# EasyEDA Pro project v4_a.eprj

# Schematic Schematic1
Board Name: Board1; Create Date: 2023-01-16; Page Name: P1; Project Name: v4_a; Schematic Name: Schematic1; Update Date: 2024-11-25; Company: KC3LBR; Drawed: EasyEDA Pro; Page Size: A3; Part Number: JLCPCB-001; Reviewed: EasyEDA Pro; Version: 2023.09.11
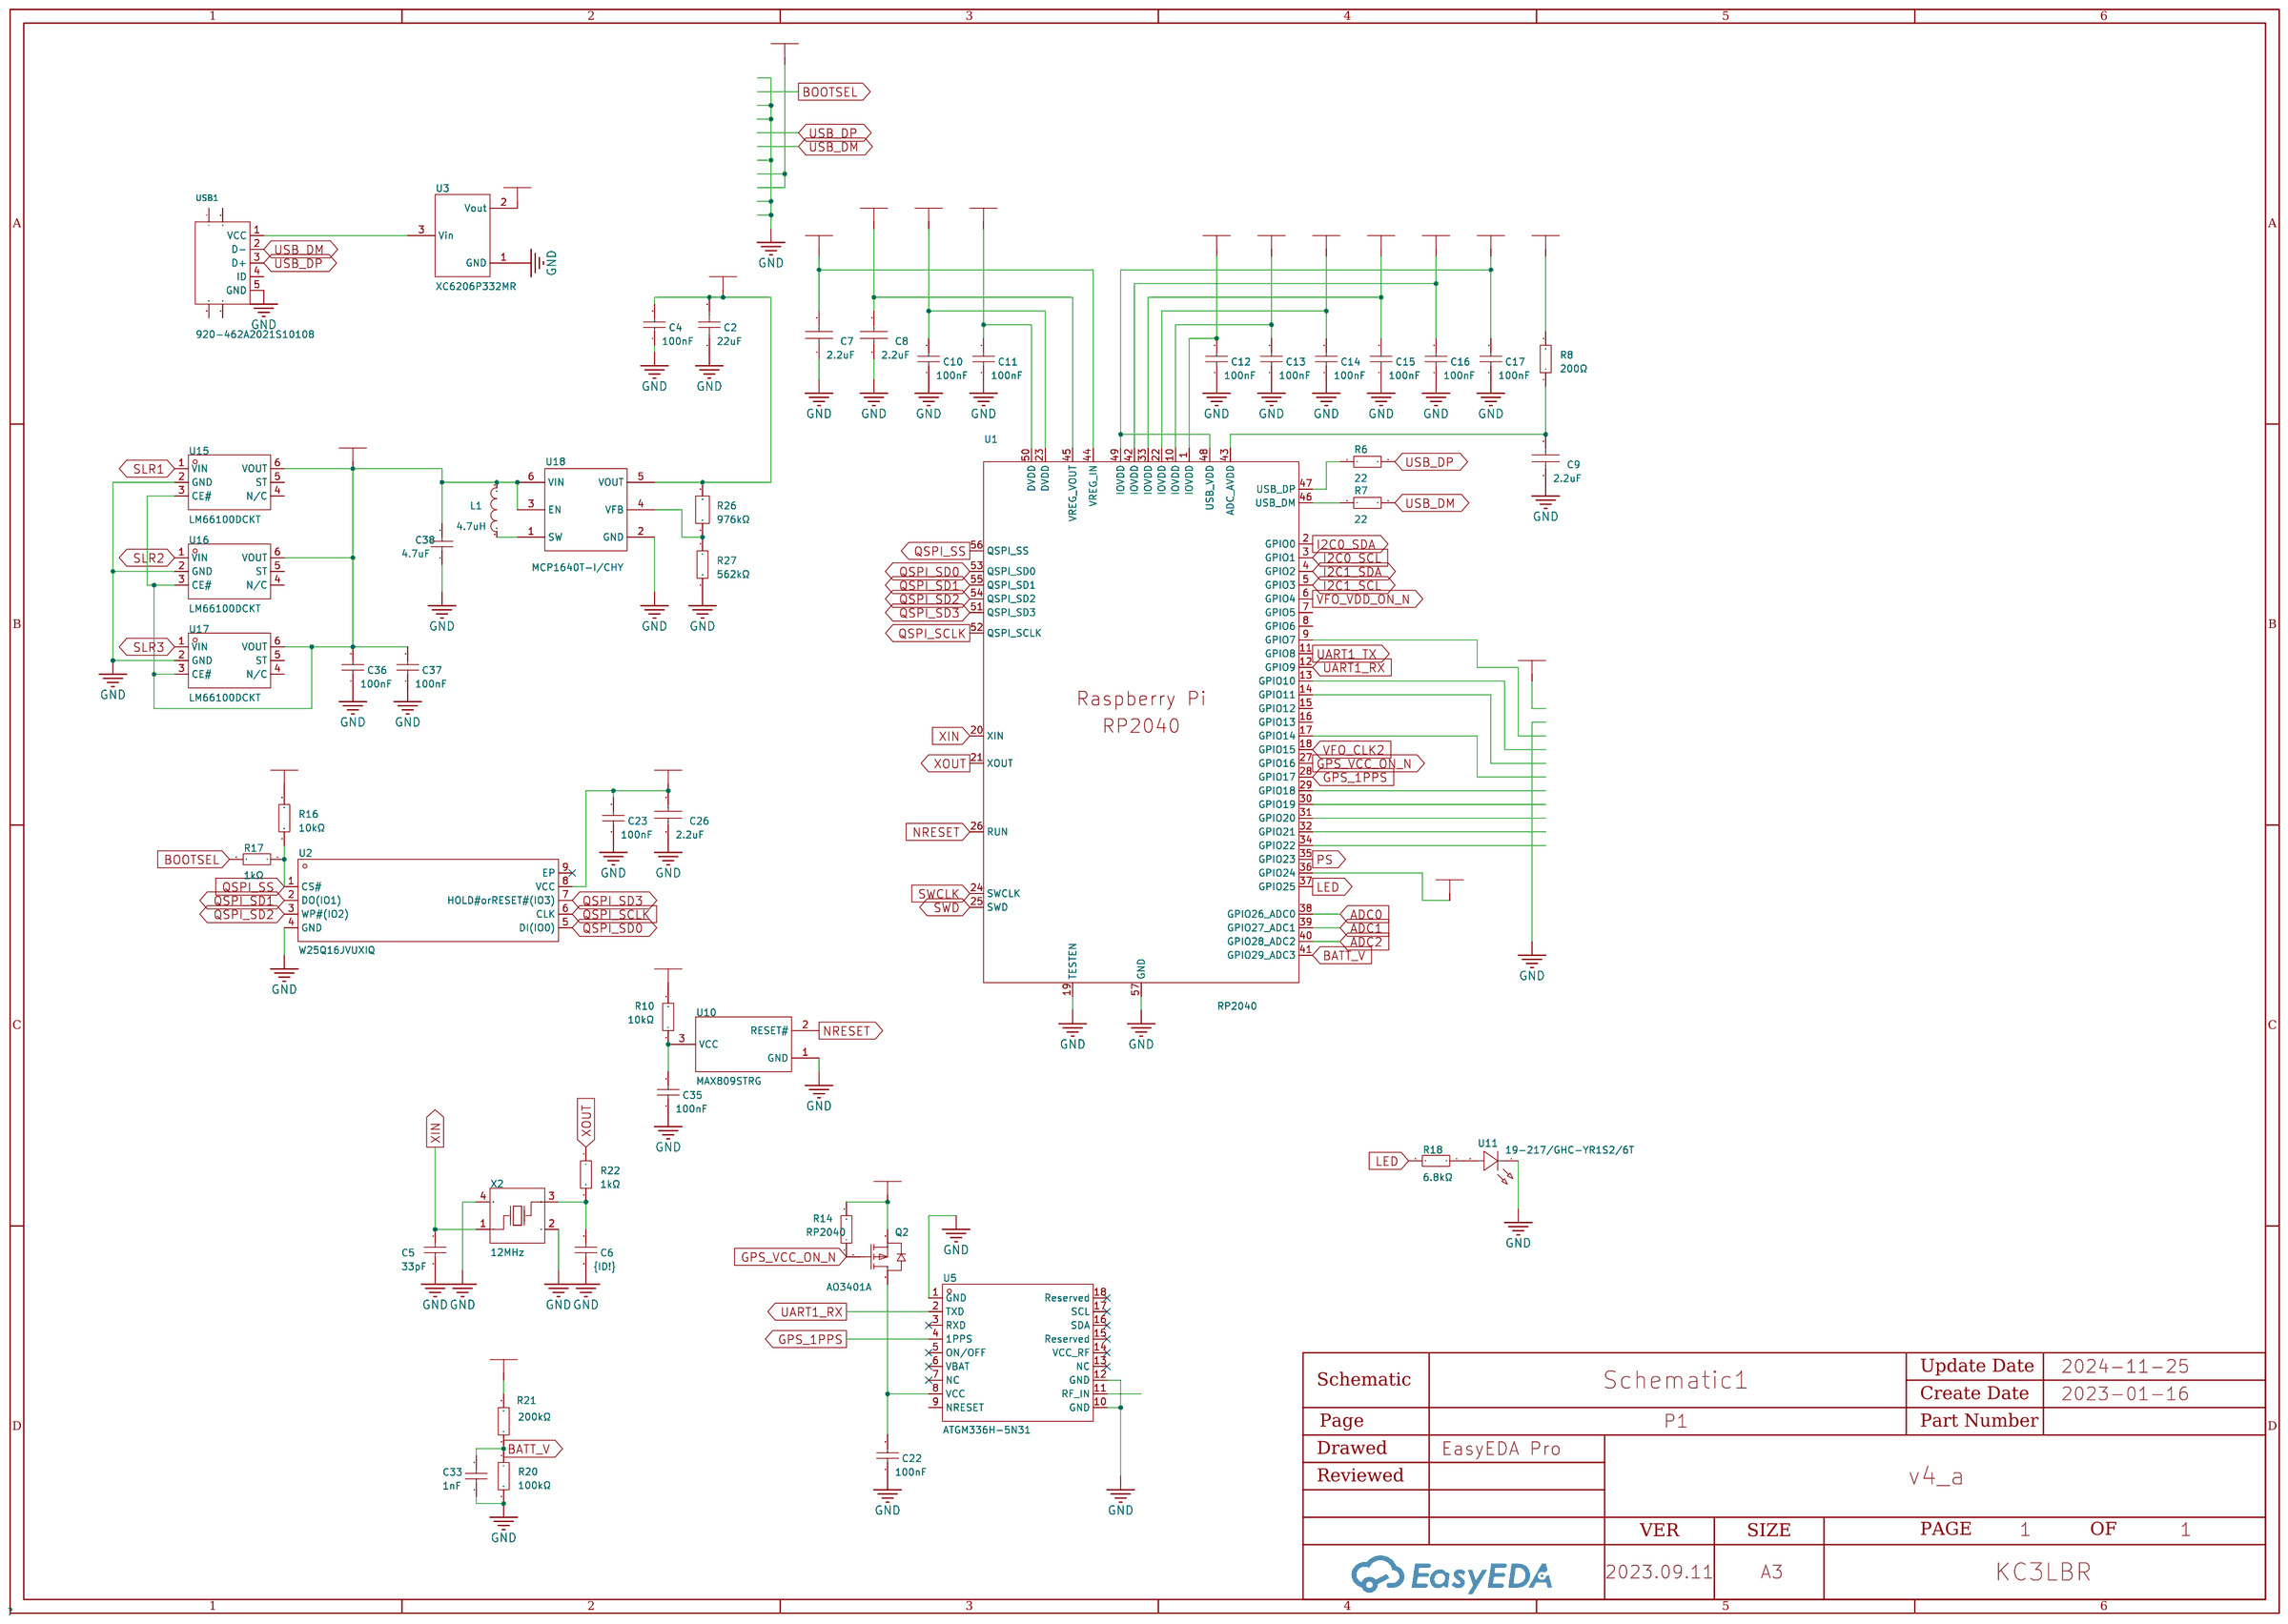
[diagram p0: schematic sheet]

## Parts
C2  22uF  [C0603]
C4  100nF  [C0402]
C5  33pF  [C0402]
C6  33pF  [C0402]
C7  2.2uF  [C0402]
C8  2.2uF  [C0402]
C9  2.2uF  [C0402]
C10  100nF  [C0402]
C11  100nF  [C0402]
C12  100nF  [C0402]
C13  100nF  [C0402]
C14  100nF  [C0402]
C15  100nF  [C0402]
C16  100nF  [C0402]
C17  100nF  [C0402]
C22  100nF  [C0402]
C23  100nF  [C0402]
C26  2.2uF  [C0402]
C33  1nF  [C0402]
C35  100nF  [C0402_NEW]
C36  100nF  [C0402_NEW]
C37  100nF  [C0402_NEW]
C38  4.7uF  [C0603]
L1  4.7uH  [IND-SMD_L2.5-W1.8]
Q2  AO3401A  [SOT-23_L2.9-W1.3-P1.90-LS2.4-BR]
R6  22  [R0402]
R7  22  [R0402]
R8  200Ω  [R0402]
R10  10kΩ  [R0402]
R14  RP2040  [LQFN-56_L7.0-W7.0-P0.4-EP]
R16  10kΩ  [R0402]
R17  1kΩ  [R0402]
R18  6.8kΩ  [R0402]
R20  100kΩ  [R0402]
R21  200kΩ  [R0402]
R22  1kΩ  [R0402]
R26  976kΩ  [R0402]
R27  562kΩ  [R0402]
U1  RP2040  [LQFN-56_L7.0-W7.0-P0.4-EP]
U2  W25Q16JVUXIQ  [USON-8_L3.0-W2.0-P0.50-BL-EP]
U3  XC6206P332MR  [SOT-23-3_L2.9-W1.3-P1.90-LS2.4-BR]
U5  ATGM336H-5N31  [GPSM-SMD_ATGM336H-TR]
U10  MAX809STRG  [SOT-23-3_L2.9-W1.6-P1.90-LS2.8-BR]
U11  19-217/GHC-YR1S2/6T  [LED0603-RD_GREEN]
U15  LM66100DCKT  [SC-70-6_L2.0-W1.3-P0.65-LS2.1-BL]
U16  LM66100DCKT  [SC-70-6_L2.0-W1.3-P0.65-LS2.1-BL]
U17  LM66100DCKT  [SC-70-6_L2.0-W1.3-P0.65-LS2.1-BL]
U18  MCP1640T-I/CHY  [SOT-23-6_L2.9-W1.6-P0.95-LS2.8-BR]
USB1  920-462A2021S10108  [MINI-USB-SMD_C105424]
X2  12MHz  [CRYSTAL-SMD_4P-L3.2-W2.5-BL]

## Library data of the parts
C2 = CL10A226MQ8NRNC: Capacitance: Tolerance:±20% Tolerance:±20% Voltage Rated: Temperature Coefficient:; LCSC Part Name: 22uF ±20% 6.3V; Supplier Part: C59461; Manufacturer: SAMSUNG(三星); Supplier Footprint: 0603; JLCPCB Part Class: Basic Part; Datasheet: https://atta.szlcsc.com/upload/public/pdf/source/20160218/1457707763339.pdf; Supplier: LCSC; Tolerance: ±20%
C4 C10-C17 C22 C23 = CL05B104KO5NNNC: Capacitance: Tolerance:±10% Tolerance:±10% Voltage Rated: Temperature Coefficient:; LCSC Part Name: 100nF ±10% 16V; Supplier Part: C1525; Manufacturer: SAMSUNG(三星); Supplier Footprint: 0402; JLCPCB Part Class: Basic Part; Datasheet: https://atta.szlcsc.com/upload/public/pdf/source/20160218/1457707763339.pdf; Supplier: LCSC; Tolerance: ±10%
C5 C6 = 0402CG330J500NT: Capacitance: Tolerance:±5% Tolerance:±5% Voltage Rated: Temperature Coefficient:; LCSC Part Name: 33pF ±5% 50V; Supplier Part: C1562; Manufacturer: FH(风华); Supplier Footprint: 0402; JLCPCB Part Class: Basic Part; Datasheet: https://atta.szlcsc.com/upload/public/pdf/source/20200305/C486355_26A10D38EF8C2A5C37091D0039909270.pdf; Supplier: LCSC; Tolerance: ±5%
C7-C9 C26 = CL05A225MQ5NSNC: Capacitance: Tolerance:±20% Tolerance:±20% Voltage Rated: Temperature Coefficient:; LCSC Part Name: 2.2uF ±20% 6.3V; Supplier Part: C12530; Manufacturer: SAMSUNG(三星); Supplier Footprint: 0402; JLCPCB Part Class: Basic Part; Datasheet: https://atta.szlcsc.com/upload/public/pdf/source/20160218/1457707763339.pdf; Supplier: LCSC; Tolerance: ±20%
C33 = 0402B102K500NT: Capacitance: Tolerance:±10% Tolerance:±10% Voltage Rated: Temperature Coefficient:; LCSC Part Name: 1nF ±10% 50V; Supplier Part: C1523; Manufacturer: FH(风华); Supplier Footprint: 0402; JLCPCB Part Class: Basic Part; Datasheet: https://atta.szlcsc.com/upload/public/pdf/source/20170923/C1523_1506149254821988331.pdf; Supplier: LCSC; Tolerance: ±10%
C35-C37 = CL05B104KO5NNNC: Capacitance: Tolerance:±10% Tolerance:±10% Voltage Rated: Temperature Coefficient:; LCSC Part Name: 100nF ±10% 16V; Supplier Part: C1525; Manufacturer: SAMSUNG(三星); Supplier Footprint: 0402; JLCPCB Part Class: Basic Part; Datasheet: https://atta.szlcsc.com/upload/public/pdf/source/20160103/1457707674891.pdf; Supplier: LCSC; Tolerance: ±10%
C38 = CL10A475KO8NNNC: Capacitance: Tolerance:±10% Tolerance:±10% Voltage Rated: Temperature Coefficient:; LCSC Part Name: 4.7uF ±10% 16V; Supplier Part: C19666; Manufacturer: SAMSUNG(三星); Supplier Footprint: 0603; JLCPCB Part Class: Basic Part; Datasheet: https://atta.szlcsc.com/upload/public/pdf/source/20160103/1457707703134.pdf; Supplier: LCSC; Tolerance: ±10%
L1 = CBC2518T4R7M: Type:- Inductance: Tolerance:±20% Tolerance:±20% Rated Current: Saturation Current (Isat):680mA DC Resistance (DCR): Ratings:-; LCSC Part Name: 4.7uH ±20% 680mA; Supplier Part: C268002; Manufacturer: TAIYO YUDEN(太诱); Supplier Footprint: SMD; JLCPCB Part Class: Extended Part; Datasheet: https://atta.szlcsc.com/upload/public/pdf/source/20180820/C268002_0E22732304EF0852B3951C6629BBBAB5.pdf; Supplier: LCSC; Tolerance: ±20%; Saturation Current (Isat): 680mA
Q2 = AO3401A_C15127: Type: Drain Source Voltage (Vdss): Continuous Drain Current (Id): Power Dissipation (Pd): Drain Source On Resistance (RDS(on)@Vgs,Id):44mΩ@10V,4.3A Gate Threshold Voltage (Vgs(th)@Id):1.3V@250uA; LCSC Part Name: P沟道 30V 4A; Supplier Part: C15127; Manufacturer: AOS; Supplier Footprint: SOT-23; JLCPCB Part Class: Basic Part; Datasheet: https://atta.szlcsc.com/upload/public/pdf/source/20160507/1462613609053.pdf; Supplier: LCSC; Drain Source On Resistance (RDS(on)@Vgs,Id): 44mΩ@10V,4.3A; Gate Threshold Voltage (Vgs(th)@Id): 1.3V@250uA
R6 R7 = 0402WGF220JTCE: LCSC Part Name: 22Ω(22R0) ±1% 编带; Supplier Part: C25092; Manufacturer: UNI-ROYAL(厚声); Supplier Footprint: 0402; JLCPCB Part Class: Basic Part; Datasheet: https://atta.szlcsc.com/upload/public/pdf/source/20170920/C25092_1505901206069982723.pdf; Supplier: LCSC
R8 = 0402WGF2000TCE: Type:Thick Film Resistors Resistance: Tolerance:±1% Tolerance:±1% Power(Watts): Temperature Coefficient:±100ppm/ Temperature Coefficient:±100ppm/ Overload Voltage (Max): Operating Temperature Range:-55~+155 Operating Temperature Range:-55~+155; LCSC Part Name: 200Ω ±1% 62.5mW; Supplier Part: C25087; Manufacturer: UNI-ROYAL(厚声); Supplier Footprint: 0402; JLCPCB Part Class: Basic Part; Datasheet: https://atta.szlcsc.com/upload/public/pdf/source/20200306/C422600_1E6D84923E4A46A82E41ADD87F860B5C.pdf; Supplier: LCSC; Type: Thick Film Resistors; Tolerance: ±1%; Temperature Coefficient: ±100ppm/; Operating Temperature Range: -55~+155
R10 R16 = 0402WGF1002TCE: Type:Thick Film Resistors Resistance: Tolerance:±1% Tolerance:±1% Power(Watts): Temperature Coefficient:±100ppm/ Temperature Coefficient:±100ppm/ Overload Voltage (Max): Operating Temperature Range:-55~+155 Operating Temperature Range:-55~+155; LCSC Part Name: 10kΩ ±1% 62.5mW; Supplier Part: C25744; Manufacturer: UNI-ROYAL(厚声); Supplier Footprint: 0402; JLCPCB Part Class: Basic Part; Datasheet: https://atta.szlcsc.com/upload/public/pdf/source/20200306/C422600_1E6D84923E4A46A82E41ADD87F860B5C.pdf; Supplier: LCSC; Type: Thick Film Resistors; Tolerance: ±1%; Temperature Coefficient: ±100ppm/; Operating Temperature Range: -55~+155
R14 = RP2040_C2040: CPU Core:- RAM Size:264KB GPIO Ports Number:30 Operating Voltage Range:- Operating Voltage Range:- CPU Maximum Speed:133MHz Program Memory Type:- Operating Temperature Range:- Operating Temperature Range:- ADC (Bit):12bit DAC (Bit):- PWM (Bit):- 8Bit Time; LCSC Part Name: RP2040（RP2B2）; Supplier Part: C2040; Manufacturer: Raspberry Pi(树莓派); Supplier Footprint: LQFN-56(7x7); JLCPCB Part Class: Extended Part; Datasheet: https://atta.szlcsc.com/upload/public/pdf/source/20210621/C2040_96F425825606B7957D87DD32E2512CA9.pdf; Supplier: LCSC; CPU Core: ARM Cortex-M0; Maximum Frequency: 133MHz; RAM Size: 264KB; GPIO Ports Number: 30; ADC (Units/Channels/bits): 1@x4ch/12bit; U(S)ART Number: 2; I2C Number: 2; (Q)SPI Number: 2; USB (H/D/OTG): USB Host/Device; Peripherals / Functions / Protocol Stacks: DMA；PWM; CPU Maximum Speed: 133MHz; ADC (Bit): 12bit; UART/USART: 2; I2C: 2; SPI: 2; Universal Serial Bus: 有; Peripheral/Function: DMA；PWM; Direct Memory Access: 有
R17 R22 = 0402WGF1001TCE: Type:Thick Film Resistors Resistance: Tolerance:±1% Tolerance:±1% Power(Watts): Temperature Coefficient:±100ppm/ Temperature Coefficient:±100ppm/ Overload Voltage (Max): Operating Temperature Range:-55~+155 Operating Temperature Range:-55~+155; LCSC Part Name: 1kΩ ±1% 62.5mW; Supplier Part: C11702; Manufacturer: UNI-ROYAL(厚声); Supplier Footprint: 0402; JLCPCB Part Class: Basic Part; Datasheet: https://atta.szlcsc.com/upload/public/pdf/source/20200306/C422600_1E6D84923E4A46A82E41ADD87F860B5C.pdf; Supplier: LCSC; Type: Thick Film Resistors; Tolerance: ±1%; Temperature Coefficient: ±100ppm/; Operating Temperature Range: -55~+155
R18 = 0402WGF6801TCE: Type:Thick Film Resistors Resistance: Tolerance:±1% Tolerance:±1% Power(Watts): Temperature Coefficient:±100ppm/ Temperature Coefficient:±100ppm/ Overload Voltage (Max): Operating Temperature Range:-55~+155 Operating Temperature Range:-55~+155; LCSC Part Name: 6.8kΩ ±1% 62.5mW; Supplier Part: C25917; Manufacturer: UNI-ROYAL(厚声); Supplier Footprint: 0402; JLCPCB Part Class: Basic Part; Datasheet: https://atta.szlcsc.com/upload/public/pdf/source/20200306/C422600_1E6D84923E4A46A82E41ADD87F860B5C.pdf; Supplier: LCSC; Type: Thick Film Resistors; Tolerance: ±1%; Temperature Coefficient: ±100ppm/; Operating Temperature Range: -55~+155
R20 = 0402WGF1003TCE: Type:Thick Film Resistors Resistance: Tolerance:±1% Tolerance:±1% Power(Watts): Temperature Coefficient:±100ppm/ Temperature Coefficient:±100ppm/ Overload Voltage (Max): Operating Temperature Range:-55~+155 Operating Temperature Range:-55~+155; LCSC Part Name: 100kΩ ±1% 62.5mW; Supplier Part: C25741; Manufacturer: UNI-ROYAL(厚声); Supplier Footprint: 0402; JLCPCB Part Class: Basic Part; Datasheet: https://atta.szlcsc.com/upload/public/pdf/source/20200306/C422600_1E6D84923E4A46A82E41ADD87F860B5C.pdf; Supplier: LCSC; Type: Thick Film Resistors; Tolerance: ±1%; Temperature Coefficient: ±100ppm/; Operating Temperature Range: -55~+155
R21 = 0402WGF2003TCE: Resistance: Tolerance: Power(Watts): Temperature Coefficient: Temperature Coefficient: Overload Voltage (Max): Operating Temperature Range: Operating Temperature Range:; LCSC Part Name: 200KΩ ±1%; Supplier Part: C25764; Manufacturer: UNI-ROYAL(厚声); Supplier Footprint: 0402; JLCPCB Part Class: Basic Part; Datasheet: https://atta.szlcsc.com/upload/public/pdf/source/20170920/C25764_1505901532268983339.pdf; Supplier: LCSC
R26 = RC0402FR-07976KL: LCSC Part Name: 厚膜电阻 976kΩ ±1% 62.5mW; Supplier Part: C273699; Manufacturer: YAGEO(国巨); Supplier Footprint: 0402; JLCPCB Part Class: Extended Part; Datasheet: https://atta.szlcsc.com/upload/public/pdf/source/20191125/C364360_EA870FADD46A2AD4DBE56DD50D360B3E.pdf; Supplier: LCSC; Type: Thick Film Resistors; Tolerance: ±1%; Temperature Coefficient: ±100ppm/℃; Operating Temperature Range: -55℃~+155℃
R27 = RC0402FR-07562KL: LCSC Part Name: 厚膜电阻 562kΩ ±1% 62.5mW; Supplier Part: C273337; Manufacturer: YAGEO(国巨); Supplier Footprint: 0402; JLCPCB Part Class: Extended Part; Datasheet: https://atta.szlcsc.com/upload/public/pdf/source/20180821/C275644_0D56F95EFF785E7D9A1FEF436B37DA78.pdf; Supplier: LCSC; Type: Thick Film Resistors; Tolerance: ±1%; Temperature Coefficient: ±100ppm/℃; Operating Temperature Range: -55℃~+155℃
U1 = RP2040_C2040: CPU Core:- RAM Size:264KB GPIO Ports Number:30 Operating Voltage Range:- Operating Voltage Range:- CPU Maximum Speed:133MHz Program Memory Type:- Operating Temperature Range:- Operating Temperature Range:- ADC (Bit):12bit DAC (Bit):- PWM (Bit):- 8Bit Time; LCSC Part Name: RP2040（RP2B2）; Supplier Part: C2040; Manufacturer: Raspberry Pi(树莓派); Supplier Footprint: LQFN-56(7x7); JLCPCB Part Class: Extended Part; Datasheet: https://atta.szlcsc.com/upload/public/pdf/source/20210621/C2040_96F425825606B7957D87DD32E2512CA9.pdf; Supplier: LCSC; Maximum Frequency: 133MHz; RAM Size: 264KB; GPIO Ports Number: 30; ADC (Units/Channels/bits): 1@x4ch/12bit; U(S)ART Number: 2; I2C Number: 2; (Q)SPI Number: 2; USB (H/D/OTG): USB Host/Device; Peripherals / Functions / Protocol Stacks: DMA；PWM; CPU Maximum Speed: 133MHz; ADC (Bit): 12bit; UART/USART: 2; I2C: 2; SPI: 2; Universal Serial Bus: 有; Peripheral/Function: DMA；PWM; Direct Memory Access: 有
U2 = W25Q16JVUXIQ: Supplier Part: C2843335; Manufacturer: WINBOND(华邦); Supplier Footprint: USON-8-EP(2x3); JLCPCB Part Class: Extended Part; Datasheet: https://atta.szlcsc.com/upload/public/pdf/source/20210629/C2843335_FB4D78B5076715625DC0C83F790D3044.pdf; Supplier: LCSC
U3 = XC6206P332MR_C6430947: Supplier Part: C6430947; Manufacturer: GOODWORK(固得沃克); Supplier Footprint: SOT-23; JLCPCB Part Class: Extended Part; Datasheet: https://atta.szlcsc.com/upload/public/pdf/source/20240218/986B5B990190AC417C3A75943F9A285D.pdf; Supplier: LCSC
U5 = ATGM336H-5N31: LCSC Part Name: BDS/GNSS 全星座定位导航模块; Supplier Part: C90770; Manufacturer: 杭州中科微; Supplier Footprint: SMD,9.7x10.1mm; JLCPCB Part Class: Extended Part; Datasheet: https://atta.szlcsc.com/upload/public/pdf/source/20161226/1482720799860.pdf; Supplier: LCSC
U10 = MAX809STRG: Output Type:推挽 Reset Active Level:低电平有效 Number of Voltages Monitored:1 Threshold Voltage:2.93V Reset Timeout:140ms Operating Temperature:-40~+105@(TJ) Operating Temperature:-40~+105@(TJ) Type of the Power Management Chip:Simple reset/Power-on reset; LCSC Part Name: Voltage Supervisor, Very Low Supply Current, 3-Pin Microprocessor, Reset Monitor; Supplier Part: C9965; Manufacturer: onsemi(安森美); Supplier Footprint: SOT-23; JLCPCB Part Class: Extended Part; Datasheet: https://atta.szlcsc.com/upload/public/pdf/source/20170918/C9965_1505727085373976535.PDF; Supplier: LCSC; Output Type: 推挽; Reset Active Level: 低电平有效; Number of Voltages Monitored: 1; Threshold Voltage: 2.93V; Reset Timeout: 140ms; Operating Temperature: -40~+105@(TJ); Type of the Power Management Chip: Simple reset/Power-on reset
U11 = 19-217/GHC-YR1S2/6T: LCSC Part Name: 翠绿; Supplier Part: C2986059; Manufacturer: EVERLIGHT(亿光); Supplier Footprint: 0603; JLCPCB Part Class: Extended Part; Datasheet: https://atta.szlcsc.com/upload/public/pdf/source/20220705/5270194960AA522E2931401D212035CB.pdf; Supplier: LCSC
U15-U17 = LM66100DCKT_C2832141: Output Current:1.5A Input Voltage:1.5V~5.5V Input Voltage:1.5V~5.5V Operating Temperature	-:-40℃~+105℃ Operating Temperature	-:-40℃~+105℃; Supplier Part: C2832141; Manufacturer: TI(德州仪器); Supplier Footprint: SC-70-6; JLCPCB Part Class: Extended Part; Datasheet: https://www.ti.com/cn/lit/gpn/lm66100; Supplier: LCSC; Output Current: 1.5A; Input Voltage: 1.5V~5.5V; Operating Temperature	-: -40℃~+105℃
U18 = MCP1640T-I/CHY: Function:Boost type Synchronous Rectification:Yes Number of Outputs:1 Topology:Boost Input Voltage:0.8V~5.5V Input Voltage:0.8V~5.5V Output Voltage:2V~5.5V Output Voltage:2V~5.5V Output Current (Max):350mA Switching Frequency:500kHz; LCSC Part Name: 升压型 Vin=0.8V~5.5V Vout=2V~5.5V 350mA; Supplier Part: C44365; Manufacturer: MICROCHIP(美国微芯); Supplier Footprint: SOT-23-6; JLCPCB Part Class: Extended Part; Datasheet: https://atta.szlcsc.com/upload/public/pdf/source/20150319/1457707270677.pdf; Supplier: LCSC; Function: Boost type; Synchronous Rectification: Yes; Number of Outputs: 1; Topology: Boost; Input Voltage: 0.8V~5.5V; Output Voltage: 2V~5.5V; Output Current (Max): 350mA; Switching Frequency: 500kHz
USB1 = 920-462A2021S10108: LCSC Part Name: Mini-B 母; Supplier Part: C105424; Manufacturer: 精拓金; Supplier Footprint: SMD; JLCPCB Part Class: Extended Part; Datasheet: https://atta.szlcsc.com/upload/public/pdf/source/20210305/C105424_2FE4567BA4C4825921316FFF365C367B.pdf; Supplier: LCSC; Connector Type: Mini-B; Standard: USB 2.0; Gender: Female; Number of Ports: 1; Number of Contacts: 5P
X2 = X322512MSB4SI: LCSC Part Name: 12MHz ±10ppm 20pF; Supplier Part: C9002; Manufacturer: YXC(扬兴晶振); Supplier Footprint: SMD3225-4P; JLCPCB Part Class: Basic Part; Datasheet: https://atta.szlcsc.com/upload/public/pdf/source/20240329/19D5F850207469550BEB00D7DFEDBC7A.pdf; Supplier: LCSC; Crystal Type: Surface Mount Crystal; Normal temperature Frequency Tolerance: ±10ppm; Frequency Stability(Full temperature range): ±20ppm

## Nets
1V1: C8.2 C10.2 C11.2 U1.23(DVDD) U1.45(VREG_VOUT) U1.50(DVDD)
3V3: C2.2 C4.2 C7.2 C12.2 C13.2 C14.2 C15.2 C16.2 C17.2 C23.2 C26.2 Q2.2(S) R8.2 R10.2 R14.2 R16.2 R26.2 U1.1(IOVDD) U1.10(IOVDD) U1.22(IOVDD) U1.33(IOVDD) U1.36(GPIO24) U1.42(IOVDD) U1.44(VREG_IN) U1.48(USB_VDD) U1.49(IOVDD) U2.8(VCC) U3.2(Vout) U18.5(VOUT)
GND: C2.1 C4.1 C5.1 C6.1 C7.1 C8.1 C9.1 C10.1 C11.1 C12.1 C13.1 C14.1 C15.1 C16.1 C17.1 C22.1 C23.1 C26.1 C33.1 C35.1 C36.1 C37.1 C38.1 R20.2 R27.1 U1.19(TESTEN) U1.57(GND) U2.4(GND) U3.1(GND) U5.1(GND) U5.10(GND) U5.12(GND) U10.1(GND) U11.1(K) U15.2(GND) U16.2(GND) U17.2(GND) U18.2(GND) USB1.5(GND) X2.2(GND) X2.4(GND)
VBUS: C36.2 C37.2 C38.2 L1.2 R21.2 U15.3(CE#) U15.6(VOUT) U16.3(CE#) U16.6(VOUT) U17.3(CE#) U17.6(VOUT) U18.3(EN) U18.6(VIN)
ADC0: U1.38(GPIO26_ADC0)
ADC1: U1.39(GPIO27_ADC1)
ADC2: U1.40(GPIO28_ADC2)
ADC_AVDD: C9.2 R8.1 U1.43(ADC_AVDD)
BATT_V: C33.2 R20.1 R21.1 U1.41(GPIO29_ADC3)
BOOTSEL: R17.2
GPIO7: U1.9(GPIO7)
GPIO10: U1.13(GPIO10)
GPIO11: U1.14(GPIO11)
GPIO14: U1.17(GPIO14)
GPIO18: U1.29(GPIO18)
GPIO19: U1.30(GPIO19)
GPIO20: U1.31(GPIO20)
GPIO21: U1.32(GPIO21)
GPIO22: U1.34(GPIO22)
GPS_1PPS: U1.28(GPIO17) U5.4(1PPS)
GPS_3V3: C22.2 Q2.3(D) U5.8(VCC)
GPS_VCC_ON_N: Q2.1(G) R14.1 U1.27(GPIO16)
I2C0_SCL: U1.3(GPIO1)
I2C0_SDA: U1.2(GPIO0)
I2C1_SCL: U1.5(GPIO3)
I2C1_SDA: U1.4(GPIO2)
LED: R18.2 U1.37(GPIO25)
NRESET: U1.26(RUN) U10.2(RESET#)
PS: U1.35(GPIO23)
QSPI_SCLK: U1.52(QSPI_SCLK) U2.6(CLK)
QSPI_SD0: U1.53(QSPI_SD0) U2.5(DI(IO0))
QSPI_SD1: U1.55(QSPI_SD1) U2.2(DO(IO1))
QSPI_SD2: U1.54(QSPI_SD2) U2.3(WP#(IO2))
QSPI_SD3: U1.51(QSPI_SD3) U2.7(HOLD#orRESET#(IO3))
QSPI_SS: R16.1 R17.1 U1.56(QSPI_SS) U2.1(CS#)
SLR1: U15.1(VIN)
SLR2: U16.1(VIN)
SLR3: U17.1(VIN)
SWCLK: U1.24(SWCLK)
SWD: U1.25(SWD)
UART1_RX: U1.12(GPIO9) U5.2(TXD)
UART1_TX: U1.11(GPIO8)
USB_DM: R7.2 USB1.2(D-)
USB_DP: R6.2 USB1.3(D+)
VFO_CLK2: U1.18(GPIO15)
VFO_VDD_ON_N: U1.6(GPIO4)
XIN: C5.2 U1.20(XIN) X2.1(OSC1)
XOUT: R22.1 U1.21(XOUT)
$1N22007: R7.1 U1.46(USB_DM)
$1N22362: R6.1 U1.47(USB_DP)
$1N70752: C6.2 R22.2 X2.3(OSC2)
$1N115739: C35.2 R10.1 U10.3(VCC)
$1N146095: R18.1 U11.2(A)
$1N146351: U3.3(Vin) USB1.1(VCC)
$1N152319: L1.1 U18.1(SW)
$1N152323: R26.1 R27.2 U18.4(VFB)

Not connected (* = marked no-connect by the designer): U1 7(GPIO5) 8(GPIO6) 15(GPIO12) 16(GPIO13); U2 9(EP)*; U5 3(RXD)* 5(ON/OFF)* 6(VBAT)* 7(NC)* 9(NRESET) 11(RF_IN) 13(NC)* 14(VCC_RF)* 15(Reserved)* 16(SDA)* 17(SCL)* 18(Reserved)*; U15 4(N/C) 5(ST); U16 4(N/C) 5(ST); U17 4(N/C) 5(ST); USB1 4(ID) 6 7 8 9

# Board PCB1
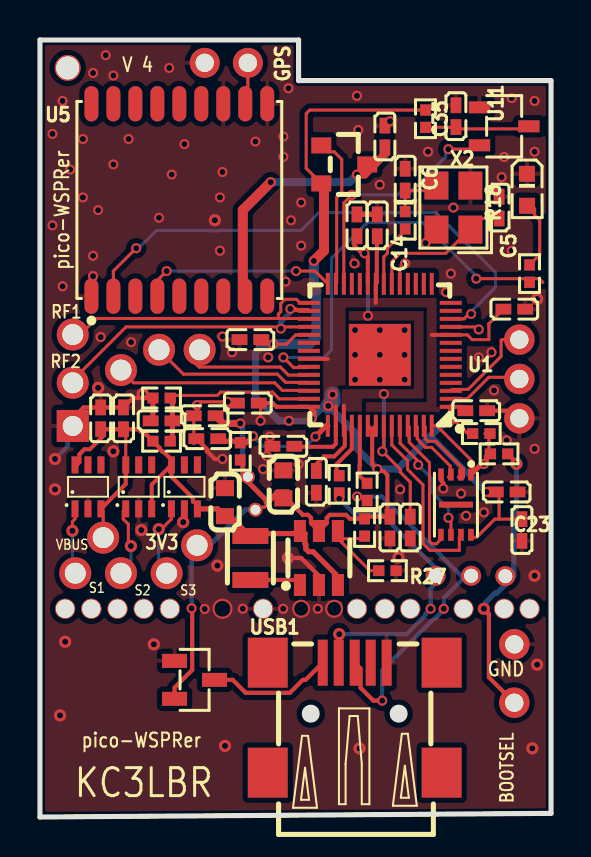
[diagram p1: board, top side]
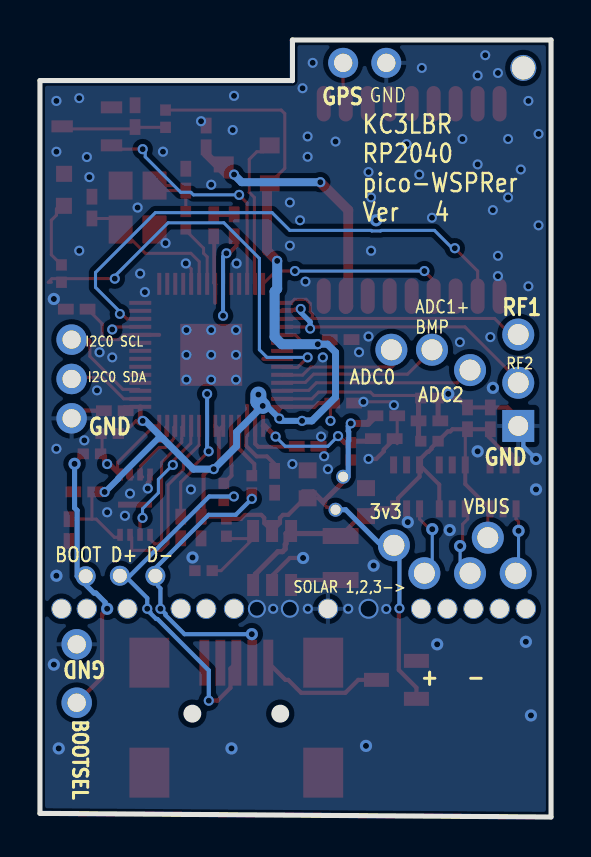
[diagram p2: board, bottom side, seen from below]

Outline 25.58 x 38.86 mm; copper layers: Top Layer, Bottom Layer. Coordinates in mm from the lower left corner of the outline.
Outline path: 0,38.86 0,0 25.58,0.18 25.58,36.83 12.94,36.83 12.94,38.86 0,38.86
Stack: Top Layer 0.035mm / Dielectric1 1.51mm FR4 er 4.5 / Bottom Layer 0.035mm

## Design rules (mm)
template: User Custom Config
spacing safeClearance (default): track to track 0.152, other pairs 0.12 to 0.3
track width trackWidth (default): min 0.127, default 0.21, max 2.54
differential pair differentialPair (default): width min 0.127, default 0.254, max 2.54; gap min 0.152, default 0.152
via viaSize (default): diameter min 0.5, default 0.61, max 10; hole min 0.3, default 0.305, max 5.999

## Placement (name value [footprint] x y rotation side)
C2  22uF  [C0603]  12.18 16.64 270 top
C4  100nF  [C0402]  8.24 20.07 0 top
C5  33pF  [C0402]  22.98 30.48 270 top
C6  33pF  [C0402]  18.28 31.88 270 top
C7  2.2uF  [C0402]  12.18 18.54 0 top
C8  2.2uF  [C0402]  13.83 16.77 90 top
C9  2.2uF  [C0402]  8.37 18.92 0 top
C10  100nF  [C0402]  15.86 29.59 270 top
C11  100nF  [C0402]  18.53 14.48 90 top
C12  100nF  [C0402]  21.83 20.32 180 top
C13  100nF  [C0402]  23.74 25.4 180 top
C14  100nF  [C0402]  16.88 29.59 270 top
C15  100nF  [C0402]  10.53 23.88 0 top
C16  100nF  [C0402]  10.4 20.7 0 top
C17  100nF  [C0402]  17.52 14.48 90 top
C22  100nF  [C0402]  17.26 34.04 270 top
C23  100nF  [C0402]  24.12 14.35 90 top
C26  2.2uF  [C0402]  23.36 16.26 180 top
C33  1nF  [C0402]  6.09 19.81 0 top
C35  100nF  [C0402_NEW]  20.82 35.05 270 top
C36  100nF  [C0402_NEW]  4.18 19.94 270 top
C37  100nF  [C0402_NEW]  3.04 19.94 270 top
C38  4.7uF  [C0603]  9.26 15.75 270 top
L1  4.7uH  [IND-SMD_L2.5-W1.8]  10.53 12.96 90 top
NOREF  -  [Pad_e1012]  8.24 37.72 0 top
NOREF#2  -  [Pad_e35]  1.64 24.13 0 top
NOREF#3  -  [Pad_e1297]  17.26 10.42 0 top
NOREF#4  -  [Pad_e1307]  1.26 10.42 0 top
NOREF#5  -  [Pad_e2986]  10.78 15.37 0 top
NOREF#6  -  [Pad_e1471]  1.77 12.19 0 top
NOREF#7  -  [Pad_e3723]  23.23 10.42 0 top
NOREF#8  -  [Pad_e1306]  3.88 10.42 0 top
NOREF#9  -  [Pad_e5893]  10.4 17.02 0 top
NOREF#10  -  [Pad_e230]  23.74 8.64 0 top
NOREF#11  -  [Pad_e5990]  11.17 10.42 0 top
NOREF#12  -  [Pad_e1296]  15.86 10.42 0 top
NOREF#13  -  [Pad_e5896]  1.39 37.47 0 top
NOREF#14  -  [Pad_e3799]  23.99 19.94 0 top
NOREF#15  -  [Pad_e42]  4.05 22.35 0 top
NOREF#16  -  [Pad_e1203]  2.57 10.42 0 top
NOREF#17  -  [Pad_e1301]  21.2 10.42 0 top
NOREF#18  -  [Pad_e3749]  23.29 12.05 0 top
NOREF#19  -  [Pad_e1298]  18.53 10.42 0 top
NOREF#20  -  [Pad_e568]  10.4 37.72 0 top
NOREF#21  -  [Pad_e66]  21.58 12.07 0 top
NOREF#22  -  [Pad_e369]  23.99 23.88 0 top
NOREF#23  -  [Pad_e19]  1.64 19.56 0 top
NOREF#24  -  [Pad_e2]  7.86 13.59 0 top
NOREF#25  -  [Pad_e40]  7.99 23.37 0 top
NOREF#26  -  [Pad_e1477]  6.34 12.19 0 top
NOREF#27  -  [Pad_e33]  1.64 21.72 0 top
NOREF#28  -  [Pad_e54]  23.74 5.72 0 top
NOREF#29  -  [Pad_e370]  23.99 21.91 0 top
NOREF#30  -  [Pad_e41]  5.96 23.37 0 top
NOREF#31  -  [Pad_e1476]  4.05 12.19 0 top
NOREF#32  -  [Pad_e1583]  3.16 13.97 0 top
NOREF#33  -  [Pad_e1293]  6.5 10.42 0 top
NOREF#34  -  [Pad_e1299]  24.5 10.42 0 top
NOREF#35  -  [Pad_e854]  5.19 10.42 0 top
NOREF#36  -  [Pad_e2975]  19.8 12.07 0 top
Q2  AO3401A  [SOT-23_L2.9-W1.3-P1.90-LS2.4-BR]  15.23 32.64 180 top
R6  22  [R0402]  16.37 16.26 270 top
R7  22  [R0402]  14.98 16.64 270 top
R8  200Ω  [R0402]  10.02 18.29 270 top
R10  10kΩ  [R0402]  19.29 34.93 90 top
R16  10kΩ  [R0402]  22.09 19.18 180 top
R17  1kΩ  [R0402]  22.98 18.16 0 top
R18  6.8kΩ  [R0402]  24.5 27.18 270 top
R20  100kΩ  [R0402]  6.09 20.96 180 top
R21  200kΩ  [R0402]  6.09 18.8 180 top
R22  1kΩ  [R0402]  18.28 29.85 90 top
R26  976kΩ  [R0402]  16.25 14.48 90 top
R27  562kΩ  [R0402]  17.39 12.32 180 top
U1  RP2040  [LQFN-56_L7.0-W7.0-P0.4-EP]  17.01 23.12 180 top
U2  W25Q16JVUXIQ  [USON-8_L3.0-W2.0-P0.50-BL-EP]  20.82 15.62 180 top
U3  XC6206P332MR  [SOT-23-3_L2.9-W1.3-P1.90-LS2.4-BR]  7.74 6.86 180 top
U5  ATGM336H-5N31  [GPSM-SMD_ATGM336H-TR]  6.97 30.86 180 top
U10  MAX809STRG  [SOT-23-3_L2.9-W1.6-P1.90-LS2.8-BR]  23.23 34.55 180 top
U11  19-217/GHC-YR1S2/6T  [LED0603-RD_GREEN]  24.37 31.37 270 top
U15  LM66100DCKT  [SC-70-6_L2.0-W1.3-P0.65-LS2.1-BL]  2.4 16.51 0 top
U16  LM66100DCKT  [SC-70-6_L2.0-W1.3-P0.65-LS2.1-BL]  4.94 16.51 0 top
U17  LM66100DCKT  [SC-70-6_L2.0-W1.3-P0.65-LS2.1-BL]  7.23 16.51 0 top
U18  MCP1640T-I/CHY  [SOT-23-6_L2.9-W1.6-P0.95-LS2.8-BR]  13.96 12.96 270 top
USB1  920-462A2021S10108  [MINI-USB-SMD_C105424]  15.75 4.97 0 top
X2  12MHz  [CRYSTAL-SMD_4P-L3.2-W2.5-BL]  20.69 30.48 90 top

## Footprints (pads in the part's own frame, mm; a bottom-side part is the same pattern mirrored in y, then rotated)
C0402
  rect 0.79x0.54 smd: 1(-0.545,0) 2(0.545,0)
C0402_NEW
  rect 0.79x0.54 smd: 1(-0.545,0) 2(0.545,0)
C0603
  rect 0.8x0.9 smd: 1(-0.7,0) 2(0.7,0)
CRYSTAL-SMD_4P-L3.2-W2.5-BL
  rect 1.4x1.2 smd: 1(-1.1,-0.85) 2(1.1,-0.85) 3(1.1,0.85) 4(-1.1,0.85)
GPSM-SMD_ATGM336H-TR
  oval 0.7x1.773 smd: 1(4.4,4.811) 2(3.3,4.811) 3(2.2,4.811) 4(1.1,4.811) 5(0,4.811) 6(-1.1,4.811) 7(-2.2,4.811) 8(-3.3,4.811) 9(-4.4,4.811) 10(-4.4,-4.811) 11(-3.3,-4.811) 12(-2.2,-4.811) 13(-1.1,-4.811) 14(0,-4.811) 15(1.1,-4.811) 16(2.2,-4.811) 17(3.3,-4.811) 18(4.4,-4.811)
IND-SMD_L2.5-W1.8
  rect 0.8x1.8 smd: 1(-1.1,0) 2(1.1,0)
LED0603-RD_GREEN
  rect 0.8x0.8 smd: 1(-0.799,-0.004) 2(0.799,0.004)
LQFN-56_L7.0-W7.0-P0.4-EP
  rect 1.1x0.2 smd: 1(-3.55,2.6) 2(-3.55,2.2) 3(-3.55,1.8) 4(-3.55,1.4) 5(-3.55,1) 6(-3.55,0.6) 7(-3.55,0.2) 8(-3.55,-0.2) 9(-3.55,-0.6) 10(-3.55,-1) 11(-3.55,-1.4) 12(-3.55,-1.8) 13(-3.55,-2.2) 14(-3.55,-2.6) 29(3.55,-2.6) 30(3.55,-2.2) 31(3.55,-1.8) 32(3.55,-1.4) 33(3.55,-1) 34(3.55,-0.6) 35(3.55,-0.2) 36(3.55,0.2) 37(3.55,0.6) 38(3.55,1) 39(3.55,1.4) 40(3.55,1.8) 41(3.55,2.2) 42(3.55,2.6)
  rect 0.2x1.1 smd: 15(-2.6,-3.55) 16(-2.2,-3.55) 17(-1.8,-3.55) 18(-1.4,-3.55) 19(-1,-3.55) 20(-0.6,-3.55) 21(-0.2,-3.55) 22(0.2,-3.55) 23(0.6,-3.55) 24(1,-3.55) 25(1.4,-3.55) 26(1.8,-3.55) 27(2.2,-3.55) 28(2.6,-3.55) 43(2.6,3.55) 44(2.2,3.55) 45(1.8,3.55) 46(1.4,3.55) 47(1,3.55) 48(0.6,3.55) 49(0.2,3.55) 50(-0.2,3.55) 51(-0.6,3.55) 52(-1,3.55) 53(-1.4,3.55) 54(-1.8,3.55) 55(-2.2,3.55) 56(-2.6,3.55)
  rect 3.1x3.1 smd: 57(0,0)
MINI-USB-SMD_C105424
  rect 0.5x2.3 smd: 1(-1.6,2.75) 2(-0.8,2.75) 3(0,2.75) 4(0.8,2.75) 5(1.6,2.75)
  rect 2x2.5 smd: 6(4.35,2.75) 7(4.35,-2.75) 8(-4.35,2.75) 9(-4.35,-2.75)
Pad_e2
  round 1.6 hole 1.05: 15(0,0)
Pad_e19
  rect 1.6x1.6 hole 1: 7(0,0)
Pad_e33
  round 1.6 hole 1.05: 14(0,0)
Pad_e35
  round 1.6 hole 1.05: 15(0,0)
Pad_e40
  round 1.6 hole 1.05: 15(0,0)
Pad_e41
  round 1.6 hole 1.05: 17(0,0)
Pad_e42
  round 1.6 hole 1.05: 18(0,0)
Pad_e54
  round 1.524 hole 0.914: 17(0,0)
Pad_e66
  round 1 hole 0.7: 75(0,0)
Pad_e230
  round 1.524 hole 0.914: 118(0,0)
Pad_e369
  round 1.524 hole 0.914: 108(0,0)
Pad_e370
  round 1.524 hole 0.914: 111(0,0)
Pad_e568
  round 1.5 hole 0.914: 4(0,0)
Pad_e854
  round 1.016 hole 0.914: 0(0,0)
Pad_e1012
  round 1.5 hole 0.914: 9(0,0)
Pad_e1203
  round 1.016 hole 0.914: 15(0,0)
Pad_e1293
  round 1.016 hole 0.914: 1(0,0)
Pad_e1296
  round 1.016 hole 0.914: 4(0,0)
Pad_e1297
  round 1.016 hole 0.914: 5(0,0)
Pad_e1298
  round 1.016 hole 0.914: 6(0,0)
Pad_e1299
  round 1.016 hole 0.914: 7(0,0)
Pad_e1301
  round 1 hole 0.9: 23(0,0)
Pad_e1306
  round 1.016 hole 0.914: 14(0,0)
Pad_e1307
  round 1.016 hole 0.914: 15(0,0)
Pad_e1471
  round 1.6 hole 1.05: 18(0,0)
Pad_e1476
  round 1.6 hole 1.05: 18(0,0)
Pad_e1477
  round 1.6 hole 1.05: 18(0,0)
Pad_e1583
  round 1.6 hole 1.05: 18(0,0)
Pad_e2975
  round 1 hole 0.7: 79(0,0)
Pad_e2986
  round 0.7 hole 0.5: 116(0,0)
Pad_e3723
  round 1.016 hole 0.914: 7(0,0)
Pad_e3749
  round 1 hole 0.7: 75(0,0)
Pad_e3799
  round 1.524 hole 0.914: 106(0,0)
Pad_e5893
  round 0.7 hole 0.5: 116(0,0)
Pad_e5896
  round 1.3 hole 1.152: 1(0,0)
Pad_e5990
  round 1.016 hole 0.914: 4(0,0)
R0402
  rect 0.566x0.54 smd: 1(-0.433,0) 2(0.433,0)
SC-70-6_L2.0-W1.3-P0.65-LS2.1-BL
  rect 0.35x0.85 smd: 1(-0.65,-1.1) 2(0,-1.1) 3(0.65,-1.1) 4(0.65,1.1) 5(0,1.1) 6(-0.65,1.1)
SOT-23-3_L2.9-W1.3-P1.90-LS2.4-BR
  rect 1.25x0.7 smd: 1(1,-0.95) 2(1,0.95) 3(-1,0)
SOT-23-3_L2.9-W1.6-P1.90-LS2.8-BR
  rect 1.07x0.6 smd: 1(1.235,-0.95) 2(1.235,0.95) 3(-1.235,0)
SOT-23-6_L2.9-W1.6-P0.95-LS2.8-BR
  rect 1.1x0.6 smd: 1(1.35,-0.95) 2(1.35,0) 3(1.35,0.95) 4(-1.35,0.95) 5(-1.35,0) 6(-1.35,-0.95)
SOT-23_L2.9-W1.3-P1.90-LS2.4-BR
  rect 1x0.8 smd: 1(1.15,-0.95) 2(1.15,0.95) 3(-1.15,0)
USON-8_L3.0-W2.0-P0.50-BL-EP
  rect 0.28x0.6 smd: 1(-0.75,-1.508) 2(-0.25,-1.508) 3(0.25,-1.508) 4(0.75,-1.508) 5(0.75,1.508) 6(0.25,1.508) 7(-0.25,1.508) 8(-0.75,1.508)
  rect 1.7x0.3 smd: 9(0,0)

## Nets
1V1: C8.2 C10.2 C11.2 U1.23 U1.45 U1.50
3V3: C2.2 C4.2 C7.2 C12.2 C13.2 C14.2 C15.2 C16.2 C17.2 C23.2 C26.2 NOREF#5.116 NOREF#9.116 NOREF#24.15 Q2.2 R8.2 R10.2 R16.2 R26.2 U1.1 U1.10 U1.22 U1.33 U1.36 U1.42 U1.44 U1.48 U1.49 U2.8 U3.2 U18.5
GND: C2.1 C4.1 C5.1 C6.1 C7.1 C8.1 C9.1 C10.1 C11.1 C12.1 C13.1 C14.1 C15.1 C16.1 C17.1 C22.1 C23.1 C26.1 C33.1 C35.1 C36.1 C37.1 C38.1 NOREF.9 NOREF#10.118 NOREF#11.4 NOREF#14.106 NOREF#23.7 R20.2 R27.1 U1.19 U1.57 U2.4 U3.1 U5.1 U5.10 U5.12 U10.1 U11.1 U15.2 U16.2 U17.2 U18.2 USB1.5 X2.2 X2.4
VBUS: C36.2 C37.2 C38.2 L1.2 NOREF#32.18 R21.2 U15.3 U15.6 U16.3 U16.6 U17.3 U17.6 U18.3 U18.6
ADC0: NOREF#25.15 U1.38
ADC1: NOREF#30.17 U1.39
ADC2: NOREF#15.18 U1.40
ADC_AVDD: C9.2 R8.1 U1.43
BATT_V: C33.2 R20.1 R21.1 U1.41
BOOTSEL: NOREF#18.75 NOREF#28.17 R17.2
GPIO7: U1.9
GPIO10: U1.13
GPIO11: U1.14
GPIO14: U1.17
GPIO20: NOREF#2.15 U1.29 U1.31
GPIO21: NOREF#27.14 U1.30 U1.32
GPIO22: U1.34
GPS_1PPS: U1.28 U5.4
GPS_3V3: C22.2 Q2.3 U5.8
GPS_VCC_ON_N: Q2.1 U1.27
I2C0_SCL: NOREF#22.108 U1.3
I2C0_SDA: NOREF#29.111 U1.2
I2C1_SCL: U1.5
I2C1_SDA: U1.4
LED: R18.2 U1.37
NRESET: U1.26 U10.2
PS: U1.35
QSPI_SCLK: U1.52 U2.6
QSPI_SD0: U1.53 U2.5
QSPI_SD1: U1.55 U2.2
QSPI_SD2: U1.54 U2.3
QSPI_SD3: U1.51 U2.7
QSPI_SS: R16.1 R17.1 U1.56 U2.1
SLR1: NOREF#6.18 U15.1
SLR2: NOREF#31.18 U16.1
SLR3: NOREF#26.18 U17.1
SWCLK: U1.24
SWD: U1.25
UART1_RX: U1.12 U5.2
UART1_TX: U1.11
USB_DM: NOREF#36.79 R7.2 USB1.2
USB_DP: NOREF#21.75 R6.2 USB1.3
VFO_CLK2: U1.18
VFO_VDD_ON_N: U1.6
XIN: C5.2 U1.20 X2.1
XOUT: R22.1 U1.21
$1N22007: R7.1 U1.46
$1N22362: R6.1 U1.47
$1N70752: C6.2 R22.2 X2.3
$1N115739: C35.2 R10.1 U10.3
$1N146095: R18.1 U11.2
$1N146351: U3.3 USB1.1
$1N150578: NOREF#20.4 U5.11
$1N152319: L1.1 U18.1
$1N152323: R26.1 R27.2 U18.4

Pads without a net: NOREF#3 5; NOREF#4 15; NOREF#7 7; NOREF#8 14; NOREF#12 4; NOREF#13 1; NOREF#16 15; NOREF#17 23; NOREF#19 6; NOREF#33 1; NOREF#34 7; NOREF#35 0; U1 7 8 15 16; U2 9; U5 3 5 6 7 9 13 14 15 16 17 18; U15 4 5; U16 4 5; U17 4 5; USB1 4 6 7 8 9

## Via types
v1: diameter 0.508, hole 0.3, Top Layer to Bottom Layer, 84 vias
v2: diameter 0.5, hole 0.3, Top Layer to Bottom Layer, 37 vias
v3: diameter 0.61, hole 0.305, Top Layer to Bottom Layer, 26 vias
v4: diameter 1, hole 0.8, Top Layer to Bottom Layer, 1 via
v5: diameter 0.9, hole 0.7, Top Layer to Bottom Layer, 2 vias
v6: diameter 0.5, hole 0.305, Top Layer to Bottom Layer, 1 via

## Routing (per net, layer and track width the routed paths; a pad name or vN(x,y) marks a point on that pad's centre or on a via; arc(x,y) is an arc through that point)
1V1: length 18.3
  Top Layer w0.154: C11.2 18.53,16.75 18.04,17.24 18.04,17.38 17.21,18.22 U1.50
  Top Layer w0.2: U1.23 16.41,28.03 v2(16.25,28.2) 16.12,28.2 15.74,28.58 15.74,29.03 ; C8.2 13.67,17.47 13.67,17.53 13.71,17.53 14.21,18.04 14.73,18.04 15.26,18.56 15.26,19.52 U1.45 15.21,20.58
  Top Layer w0.254: v1(17.13,18.29) 17.21,18.22
  Bottom Layer w0.2: v1(17.13,18.29) 17.21,18.37 v1(17.21,21.16) ; v2(16.25,28.2) 16.41,28.03 v1(16.41,25.07)
3V3: length 104.8
  Top Layer w0.154: C16.2 11.04,20.61 v1(11.04,19.81) ; 11.32,15.74 11.89,16.32 12.44,16.32 ; R10.2 13.5,35.36 13.32,35.18 13.32,32.45 Q2.2 ; U1.33 12.8,24.12 12.33,23.65 v1(11.67,23.65) 10.85,23.65 C15.2 ; 22.98,14.9 C23.2 ; 22.98,14.9 22.98,16.38 ; 22.98,14.9 22.76,14.9 21.85,13.99 21.69,13.99 U2.8 ; 20.56,20.52 21.35,20.52 21.54,20.32 ; 20.6,19.65 20.77,19.81 ; 20.77,19.81 v1(20.44,19.81) ; 20.77,19.81 21.4,19.18 ; NOREF#5.116 10.91,15.5 11.23,15.5 11.67,15.94 C2.2 ; U1.10 21.39,24.12 21.63,23.88 22.47,23.88 22.47,24.63 22.44,24.65 C13.2
  Top Layer w0.2: U1.10 19.61,24.12 ; 12.62,18.52 14.66,18.52 14.81,18.67 U1.44 14.81,20.51 ; 16.88,29.17 C14.2 16.86,29.02 16.86,26.71 U1.22 16.81,25.72 ; C17.2 17.39,15.15 17.39,17.11 17.19,17.31 16.88,17.31 ; 14.43,20.52 14.38,20.52 ; U1.48 16.63,19.35 ; 16.63,19.35 16.63,19.38 U1.49 ; 16.63,19.35 16.63,17.65 v1(16.88,17.4) ; C16.2 11.65,20.7 11.83,20.52 13.46,20.52 13.7,20.28 ; U1.36 14.4,22.92
  Top Layer w0.21: U3.2 6.74,6.47 7.62,7.35 7.62,10.4 v1(7.59,10.44) ; 10.15,17.02 10.15,17.73 R8.2 ; C2.2 12.33,15.94 13.15,15.11 13.42,15.11 13.57,14.96 13.57,14.7 U18.5 14.35,14.7 14.35,14.96 14.5,15.11 15.32,15.11 15.52,14.91 R26.2 16.36,15.02 C17.2
  Top Layer w0.25: 20.56,20.52 20.56,19.93 v1(20.44,19.81)
  Top Layer w0.254: 11.32,15.74 11.32,15.85 10.15,17.02
  Top Layer w0.3: v1(13.6,19.93) 13.7,20.03 13.7,20.28
  Top Layer w0.35: v1(10.02,19.69) 9.17,19.69 C4.2
  Top Layer w0.4: v1(22.34,16.26) 22.85,16.26
  Top Layer w0.5: Q2.2 14.21,31.56 14.21,28.32 v1(13.71,27.81)
  Bottom Layer w0.154: 8.63,13.72 8.37,13.97 7.48,13.97
  Bottom Layer w0.21: 7.48,13.97 7.59,13.87 v1(7.59,10.44)
  Bottom Layer w0.25: 8.63,13.72 10.28,15.37 NOREF#5.116
  Bottom Layer w0.254: v1(10.02,19.69) 10.15,19.56 10.15,19.3 10.12,19.27 10.12,18.83 10.15,18.81 10.15,17.02
  Bottom Layer w0.3: v1(14.43,20.56) 14.23,20.56 v1(13.6,19.93) 13.48,19.81 v1(12.46,19.81) ; v1(22.34,16.26) 22.32,16.26 21.66,16.92 21.66,16.94 19.67,18.92 19.42,18.92
  Bottom Layer w0.35: v1(12.46,19.81) 11.97,19.81 10.78,20.99 10.78,23.24 11.19,23.65 v1(11.67,23.65) ; v1(14.43,20.56) 15.74,19.25 15.74,18.54 v1(16.88,17.4) 17.9,17.4 20.31,19.81 v1(20.44,19.81)
  Bottom Layer w0.5: v1(13.71,27.81) 13.71,26.41 13.83,26.29 13.83,24 13.48,23.65 v1(11.67,23.65)
  Bottom Layer w0.8: v1(14.65,21.13) 14.65,20.78 v1(14.43,20.56)
GND: length 21.1
  Top Layer w0.15: U1.19 18.01,27.42 v1(18.28,27.69)
  Top Layer w0.154: 7.7,18.67 C4.1 7.86,20.23 v1(7.86,20.6) 8.03,20.77 v1(9.39,20.77) 9.8,20.77 C16.1
  Top Layer w0.21: C12.1 23.61,20.32 NOREF#14.106 ; R20.2 4.65,20.96 C36.1 C37.1 2.19,20.49 1.39,19.69 ; U18.2 13.96,12.07 13.07,12.96 v3(12.41,12.96) ; v1(9.13,17.91) 8.75,17.91 8.37,18.29 8.37,18.38 C9.1 ; v1(20.18,16.43) 20.18,16.71 20.1,16.79 20.1,17.09 U2.4
  Top Layer w0.254: 15.74,30.14 C14.1 ; C33.1 5.65,19.93 R20.2
  Bottom Layer w0.21: 1.39,19.69 1.39,18.54 v3(0.75,17.91)
  vias: v1(2.66,27.05) v1(3.04,24) v1(8.25,10.4) v1(9.01,28.32) v1(9.13,24.03) v1(9.61,23.25) v1(10.15,10.42) v1(11.17,17.4) v1(11.36,18.05) v1(11.42,22.99) v1(11.51,19.03) v1(12.17,10.42) v1(12.94,17.65) v1(13.91,10.42) v1(15.74,27.69) v1(15.77,24.36) v1(15.77,23.12) v1(15.77,21.88) v1(15.86,36.07) v1(15.93,34.36) v1(17.01,31.62) v1(17.01,24.36) v1(17.01,23.12) v1(17.01,21.88) v1(17.52,34.8) v1(18.02,16.38) v1(18.25,24.36) v1(18.25,23.12) v1(18.25,21.88) v1(19.29,28.7) v1(19.42,33.28) v1(20.33,26.25) v1(20.56,27.18) v1(20.69,30.48) v1(21.07,16.18) v1(21.33,15.07) v1(22.21,15.24) v1(22.6,23.24) v1(23.1,32.01) v1(23.23,33.01) v1(23.36,18.84) v1(23.61,28.32) v1(24.75,35.82) v1(24.75,18.42) v2(0.62,34.16) v2(0.62,29.59) v2(1.13,35.82) v2(1.13,26.54) v2(1.51,32.39) v2(2.15,33.91) v2(2.15,30.99) v2(2.66,37.21) v2(2.66,28.07) v2(2.91,30.35) v2(3.29,38.1) v2(3.67,37.09) v2(3.67,32.64) v2(4.44,33.91) v2(4.56,23.75) v2(5.96,29.97) v2(6.47,37.47) v2(6.59,32.13) v2(7.23,33.66) v2(9.01,30.99) v2(9.13,32.26) v2(10.78,33.78) v2(11.93,37.72) v2(12.18,34.04) v2(12.18,33.02) v2(12.29,26.78) v2(12.44,36.45) v2(12.56,29.85) v2(13.07,30.74) v2(13.07,28.58) v2(21.96,22.99) v2(22.72,21.34) v2(23.61,35.95) v2(24.75,33.28) v3(0.75,16.38) v3(1.01,5.08) v3(1.26,8.76) v3(2.91,21.46) v3(3.67,18.29) v3(5.14,21.16) v3(5.07,14.35) v3(5.7,8.64) v3(7.17,14.75) v3(8.75,29.85) v3(8.88,12.57) v3(9.26,3.56) v3(15.99,3.43) v3(17.94,12.98) v3(24.64,3.43) v3(24.75,12.07) v3(24.88,25.91) v3(24.88,7.62) v4(9.13,10.42) v5(13.07,10.42) v5(14.72,10.42)
VBUS: length 27.6
  Top Layer w0.154: U16.6 4.29,19.28 ; NOREF#32.18 3.16,15.3
  Top Layer w0.2: 5.59,15.41 5.59,16.63 U17.6 ; C37.2 3.13,19.31 3.13,19.02 2.5,18.39 2.22,18.39 2.09,18.26 2.09,18.25 1.98,18.14 1.98,17.87 1.97,17.87 1.97,17.74 1.84,17.61 U15.6 ; 3.05,15.41 4.29,16.65 U16.6 ; 7.88,15.41 7.88,15.54 ; 7.66,15.94 7.66,15.76
  Top Layer w0.21: C37.2 C36.2 4.93,19.4 5.04,19.29 5.16,19.29 R21.2 5.98,18.47 5.98,18.42 6.13,18.27 6.18,18.27 6.58,17.87 U17.6 6.58,17.02 7.66,15.94
  Top Layer w0.22: L1.2 9.54,15.05 C38.2
  Top Layer w0.26: L1.2 10.65,14.18 13.26,14.18 13.26,13.67 13.3,13.63 13.3,13.41 13.44,13.27 13.67,13.27 14.8,12.15 14.8,11.85 14.91,11.73 14.91,11.22 ; C38.2 8.9,15.41 7.88,15.41
ADC0: length 6.8
  Top Layer w0.154: NOREF#25.15 7.61,22.99 7.61,22.86 7.97,22.5 12.03,22.5 12.44,22.1 13.44,22.1 U1.38
ADC1: length 8.2
  Top Layer w0.154: NOREF#30.17 7.18,22.15 11.88,22.15 12.3,21.74 13.44,21.74 U1.39
ADC2: length 9.8
  Top Layer w0.154: NOREF#15.18 4.69,21.72 11.75,21.72 12.13,21.34 13.44,21.34 U1.40
ADC_AVDD: length 6.2
  Top Layer w0.254: v1(10.66,19.05) 10.33,18.72 R8.1 9.95,18.8 9.04,18.8 ; U1.43 14.32,19.57 v1(13.79,19.03)
  Bottom Layer w0.154: v1(10.66,19.05) 11.17,18.54 13.3,18.54 v1(13.79,19.03)
BATT_V: length 9.6
  Top Layer w0.154: R20.1 6.65,21.08 8.87,21.08 9.04,21.25 11.63,21.25 11.97,20.92 U1.41
  Top Layer w0.254: R20.1 6.63,20.84 6.63,18.78 6.52,18.67
BOOTSEL: length 14
  Top Layer w0.21: v3(23.85,17.66) 23.85,17.73 R17.2 ; v3(22.21,10.42) 22.47,10.16 22.47,10.1 22.47,10.1 22.47,6.99 NOREF#28.17
  Bottom Layer w0.254: v3(22.21,10.42) 22.32,10.52 22.32,10.74 22.78,11.2 22.88,11.2 23.72,12.05 23.72,15.33 23.85,15.46 v3(23.85,17.66)
GPIO20: length 15
  Top Layer w0.154: U1.29 13.01,25.72 12.83,25.89 12.26,25.89 12.05,25.68 12.05,25.27 11.93,25.15 11.93,24.93 ; 11.93,24.93 2.83,24.93 1.39,23.5 ; 11.93,24.93 13.44,24.93 U1.31
GPIO21: length 15
  Top Layer w0.154: 13.2,24.52 4.31,24.52 1.77,21.97 1.39,21.97
  Top Layer w0.21: v6(12.53,25.41) 12.75,25.41 12.8,25.36 13.41,25.36 U1.30
  Bottom Layer w0.254: v2(12.05,24.43) 12.05,24.77 12.53,25.24 v6(12.53,25.41)
GPS_1PPS: length 10.4
  Top Layer w0.154: v1(6.34,27.31) 5.88,26.84 5.88,25.42 ; U1.28 13.77,27.31 v1(12.82,27.31)
  Bottom Layer w0.154: v1(12.82,27.31) v1(6.34,27.31)
GPS_3V3: length 13.6
  Top Layer w0.4: C22.2 17.26,33.15 16.25,32.13 v1(15.86,32.13)
  Top Layer w0.5: v1(11.55,31.75) 10.15,30.35 10.15,25.54 10.27,25.42
  Bottom Layer w0.4: v1(15.86,32.13) 15.48,31.75 v1(11.55,31.75)
GPS_VCC_ON_N: length 7.7
  Top Layer w0.154: Q2.1 14.39,33.28 14.72,33.28 15.1,32.89 15.1,31.24 14.85,30.99 14.85,26.71 U1.27
I2C0_SCL: length 5
  Top Layer w0.154: NOREF#22.108 23.12,23.88 23.08,23.84 23.08,23.04 21.42,21.39 20.63,21.39 U1.3
I2C0_SDA: length 4.5
  Top Layer w0.154: 20.62,20.92 21.38,20.92 22.46,21.99 24.61,21.99 24.63,21.97
LED: length 21.4
  Top Layer w0.154: v1(12.18,22.99) 12.69,22.48 13.42,22.48 13.46,22.52 ; 25.01,26.75 25.16,26.75 24.98,26.93 v1(21.83,26.93)
  Bottom Layer w0.154: v1(21.83,26.93) 21.83,27.05 19.17,29.72 16.37,29.72 14.59,27.94 14.59,23.37 14.21,22.99 v1(12.18,22.99)
NRESET: length 12.5
  Top Layer w0.154: v1(15.61,31.12) 15.21,30.71 U1.26 ; v1(20.44,33.4) 22.31,33.4 22.38,33.47
  Bottom Layer w0.154: v1(20.44,33.4) 20.31,33.28 20.31,33.02 18.53,31.24 18.02,31.24 17.9,31.12 v1(15.61,31.12)
QSPI_SCLK: length 6.5
  Top Layer w0.154: U1.52 18.03,19.54 18.03,18.69 18.93,17.79 v1(18.93,17.61) ; v1(20.44,14.96) 20.57,14.84 U2.6
  Bottom Layer w0.154: v1(18.93,17.61) 19.65,16.89 19.65,16.21 20.44,15.42 v1(20.44,14.96)
QSPI_SD0: length 7.2
  Top Layer w0.154: U1.53 18.48,19.49 18.48,18.92 18.48,18.92 18.48,18.74 19.49,17.73 19.49,13.79 19.62,13.67 19.84,13.67 20.07,13.9 U2.5
QSPI_SD1: length 3.9
  Top Layer w0.15: U1.55 19.28,19.49 19.28,18.92 19.41,18.79 19.81,18.79 21.2,17.4 21.2,17.01 21.19,17 20.94,17
QSPI_SD2: length 3.5
  Top Layer w0.15: 20.44,17 20.53,17.1 20.53,17.56 19.6,18.49 19.29,18.49 18.98,18.8 18.98,18.82 18.88,18.92 18.88,19.49 U1.54
QSPI_SD3: length 9.3
  Top Layer w0.154: U2.7 21.07,14.07 20.99,13.99 20.99,13.34 19.51,13.34 19.17,13.68 19.17,16.62 18.4,17.39 18.4,17.82 17.61,18.61 U1.51
QSPI_SS: length 5.9
  Top Layer w0.154: U1.56 19.86,19.57 21.69,17.73 21.69,17.26 ; 22.27,19.18 22.47,18.98 22.47,18.16
  Top Layer w0.254: U2.1 22.09,17.65 v1(22.21,17.65) 22.34,17.78 22.34,18.04 22.47,18.16
SLR1: length 3.6
  Top Layer w0.154: v3(1.63,14.31) 1.63,14.78 1.75,14.9 1.75,15.41
  Bottom Layer w0.154: 1.77,11.94 1.63,12.08 v3(1.63,14.31)
SLR2: length 3.9
  Top Layer w0.154: v3(4.55,13.55) 4.42,13.68 4.42,14.65 4.17,14.9 4.17,15.28 4.29,15.41
  Bottom Layer w0.154: 4.05,11.94 4.55,12.44 v3(4.55,13.55)
SLR3: length 4
  Top Layer w0.154: v3(5.94,14.4) 6.07,14.4 6.58,14.9 6.58,15.41
  Bottom Layer w0.154: v3(5.94,14.4) 5.94,12.34 6.34,11.94
UART1_RX: length 27.3
  Top Layer w0.15: 21.58,25.27 21.22,24.92 U1.12
  Top Layer w0.154: 3.67,25.42 3.67,25.42 3.67,27.31 v1(4.82,28.45)
  Bottom Layer w0.154: v1(4.82,28.45) 4.94,28.45 5.83,29.34 8.51,29.34 8.53,29.31 8.97,29.31 9,29.34 13.07,29.34 13.96,30.23 19.8,30.23 22.8,27.23 22.8,26.49 21.45,25.15
  vias: v2(21.58,25.16)
UART1_TX: length 1.5
  Top Layer w0.154: 20.56,24.52 21.83,24.52 v1(21.96,24.39)
USB_DM: length 13.9
  Top Layer w0.21: v3(14.98,9.15) 14.98,7.74 USB1.2
  Bottom Layer w0.21: v3(14.98,9.15) 18.34,9.15 19.3,10.1 19.3,10.16 v1(19.55,10.42) 19.55,11.43 19.67,11.56 ; v1(14.98,15.91) 15.78,15.11 17.13,15.11 19.74,12.51
USB_DP: length 17.6
  Top Layer w0.21: USB1.3 16.04,7.43 16.04,6.46 16.69,5.82 v1(17.13,5.82)
  Bottom Layer w0.21: v1(15.87,16.03) 17.11,16.03 21.2,11.94 20.21,10.95 v1(20.21,10.42) 20.06,10.27 20.06,10.2 19.76,9.9 19.7,9.9 17.13,7.34 v1(17.13,5.82)
XIN: length 7.5
  Top Layer w0.15: U1.20 17.61,27.78 18.02,28.2 20.31,28.2 22.05,29.94 23.1,29.94
XOUT: length 3.2
  Top Layer w0.15: U1.21 17.21,28.01 17.39,28.2 17.39,28.45 18.28,29.34 18.28,29.41
$1N22007: length 2.6
  Top Layer w0.2: U1.46 15.61,18.41 14.85,17.65 14.85,17.33
$1N22362: length 3
  Top Layer w0.2: U1.47 16.01,17.6 15.99,17.58 15.99,17.07 R6.1
$1N70752: length 3.6
  Top Layer w0.154: R22.2 18.28,31.33 19.57,31.33 19.82,31.58 18.92,31.58
$1N115739: length 5.3
  Top Layer w0.154: 19.29,34.49 20.8,34.49 C35.2 20.91,34.42 24.59,34.42
$1N146095: length 3.1
  Top Layer w0.154: 24.75,30.43 24.75,30.1 25.01,29.85 25.01,28.12 R18.1
$1N146351: length 6.3
  Top Layer w0.21: U3.3 9.65,6.86 10.29,6.21 12.51,6.21 13.16,6.86 13.29,6.86 USB1.1
$1N150578: length 2.4
  Top Layer w0.154: 10.4,37.34 10.4,35.17 10.27,35.04
$1N152319: length 2.6
  Top Layer w0.21: 10.53,11.86 12.76,11.86 U18.1
$1N152323: length 3.9
  Top Layer w0.154: 16.76,12.32 16.51,12.32 14.91,13.92 16.12,13.92 R26.1

## Copper pours and planes (outline as drawn; the poured copper is in the pictures)
1V1 on Top Layer: 15.1,25.3 19.2,25.3 19.2,20.27 15.1,20.27
3V3 on Top Layer: 10.15,20.25 13.83,20.25 13.83,19.62 10.15,19.62
3V3 on Top Layer: 14.17,25.96 19.85,25.96 19.85,20.27 14.17,20.27
GND on Top Layer: -2.17,54.61 29.74,54.61 29.74,-1.05 -2.17,-1.05
GND on Bottom Layer: -4.58,42.8 26.79,42.8 26.79,-1.4 -4.58,-1.4

Small or netless copper shapes (teardrops, artwork), in the pictures only: 2 on Top Layer

## Text on the board
Bottom Silkscreen Layer: I2C0 SDA | I2C0 SCL | RF2 | SOLAR 1,2,3-> | ADC1+ / BMP | GND | VBUS | ADC2 | 3v3 | ADC0 | BOOT D+ D- | BOOTSEL | RF1 | - | + | GPS | KC3LBR / RP2040 / pico-WSPRer / Ver   4
Top Silkscreen Layer: VBUS | S1 | S2 | S3 | RF2 | RF1 | BOOTSEL | pico-WSPRer | V 4 | GND | 3V3 | GPS | KC3LBR
